# Altium schematic sheet Smartfin Main PCBA Wet Dry Sensor.SchDoc
size Letter; TOCFontName: Consolas; TOCFontSize: 24; TOCFontColor: 0; TOCFontAttributes: 0; TOCMaxLinesInTable: 25; TOCVerticalOffset: 200; TOCHorizontalOffset: 500; TOCHorizontalSeparation: 800; TOCVerticalSeparation: 30; TOCHorizTableSize: 640; PageSetup: Record=PageOptions|CenterHorizontal=True|CenterVertical=True|PrintScale=0.96|XCorrection=1.00|YCorrection=1.00|PrintKind=0|BorderSize=5000000|LeftOffset=0|BottomOffset=0|Orientation=2|PaperLength=1000|PaperWidth=1000|Scale=100|PaperSource=7|PrintQuality=-4|MediaType=1|DitherType=10|PaperKind=11" x 17"|PrintScaleMode=1; SheetNumber: 7; SheetTotal: 8
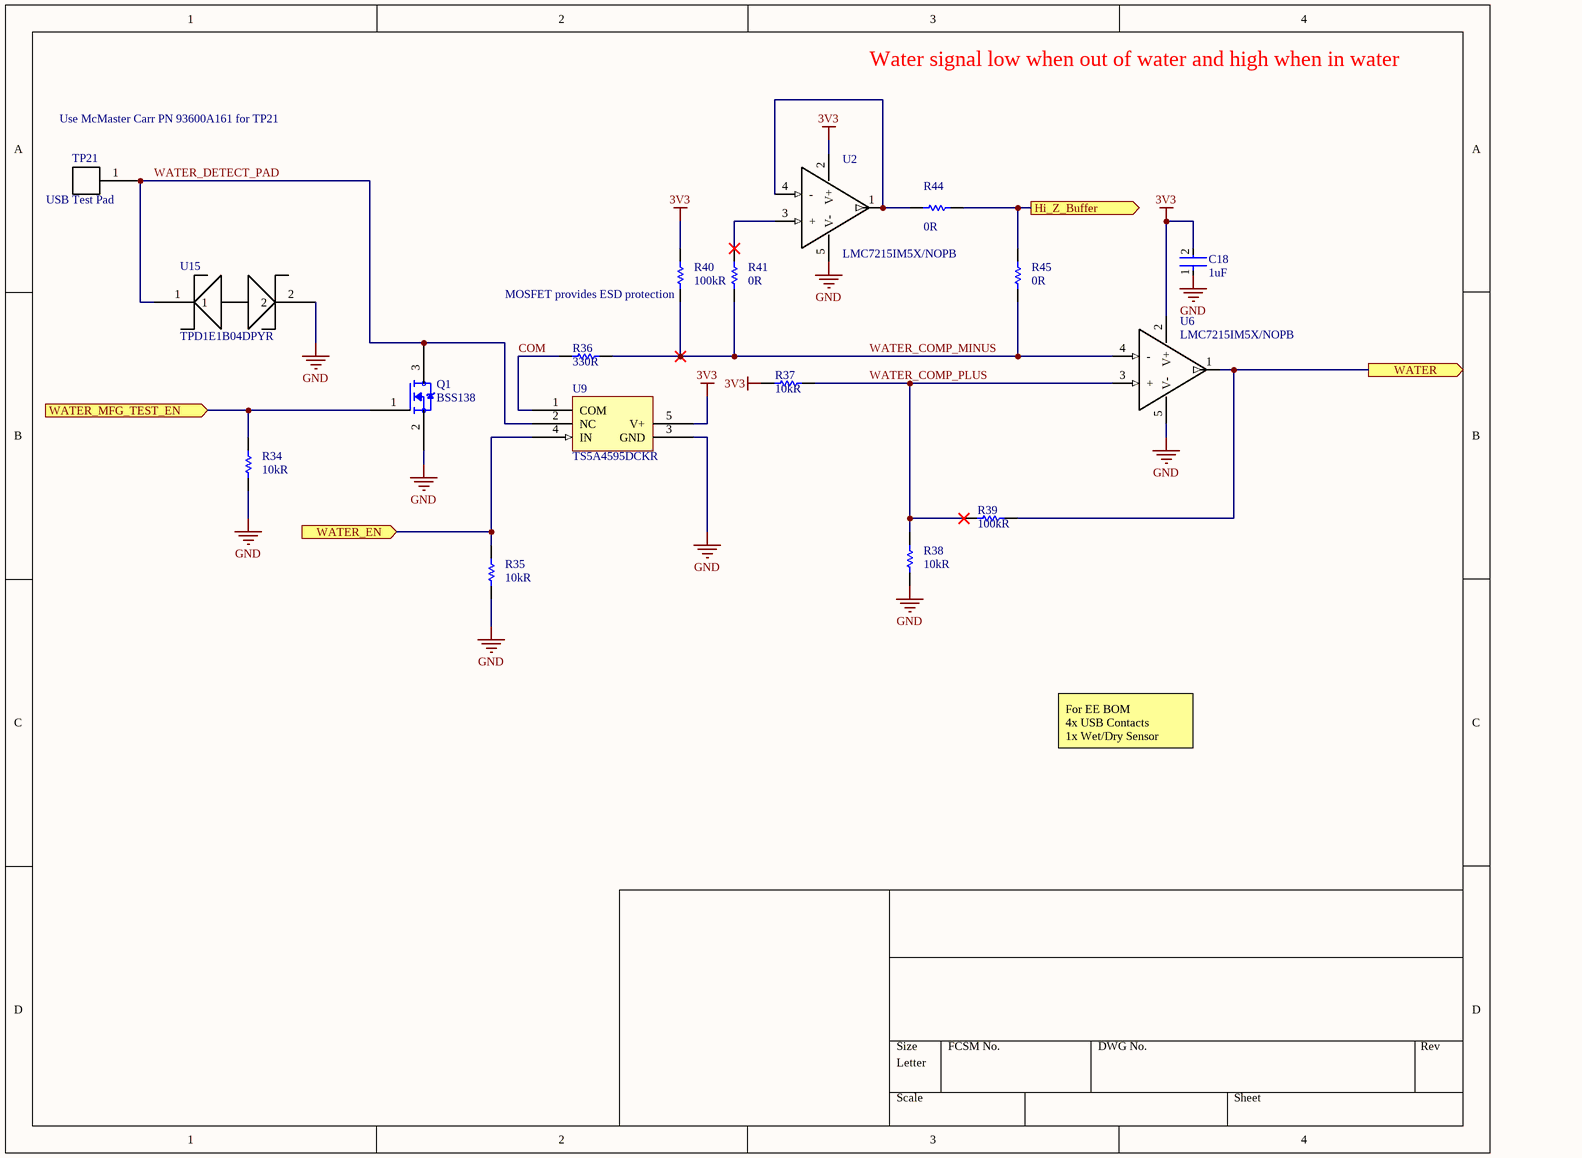
[diagram p0: Smartfin Main PCBA Wet Dry Sensor.SchDoc]

## Parts
C18  value 1uF  [FP-CC0402-IPC_C]  (hidden comment: cc0402krx5r6bb105)
Q1  BSS138  [SOT95P237X111-3N]
R34  value 10kR  [RESC1005X04N]  (hidden comment: RC0402FR-0710KL)
R35  value 10kR  [RESC1005X04N]  (hidden comment: RC0402FR-0710KL)
R36  value 330R  [RESC1005X04N]  (hidden comment: RC0402FR-07330RL)
R37  value 10kR  [RESC1005X04N]  (hidden comment: RC0402FR-0710KL)
R38  value 10kR  [RESC1005X04N]  (hidden comment: RC0402FR-0710KL)
R39  value 100kR  [RESC1005X04N]  (hidden comment: RC0402FR-07100KL)
R40  value 100kR  [RESC1005X04N]  (hidden comment: RC0402FR-07100KL)
R41  value 0R  [RESC1005X04N]  (hidden comment: RC0402JR-070RL)
R44  value 0R  [RESC1005X04N]  (hidden comment: RC0402JR-070RL)
R45  value 0R  [RESC1005X04N]  (hidden comment: RC0402JR-070RL)
TP21  USB Test Pad  [New footprint 1]
U2  LMC7215IM5X/NOPB  [SOT95P280X145-5N]
U6  LMC7215IM5X/NOPB  [SOT95P280X145-5N]
U9  TS5A4595DCKR  [SOT65P210X110-5N]
U15  TPD1E1B04DPYR  [DIO_TPD1E05U06DPYR]

## Ports
Hi_Z_Buffer (out), WATER (out), WATER_EN (in), WATER_MFG_TEST_EN (in)

## Nets
3V3: C18.2 R37.2 R40.1 U2.2(V+) U6.2(V+) U9.5(V+)
GND: C18.1 Q1.2 R34.1 R35.1 R38.2 U2.5(V-) U6.5(V-) U9.3(GND) U15.2
COM: R36.2 U9.1(COM)
Hi_Z_Buffer: R44.2 R45.2 ; port Hi_Z_Buffer
WATER: R39.1 U6.1(OUT) ; port WATER
WATER_COMP_MINUS: R36.1 R40.2 R41.1 R45.1 U6.4(-)
WATER_COMP_PLUS: R37.1 R38.1 R39.2 U6.3(+)
WATER_DETECT_PAD: Q1.3 TP21.1 U9.2(NC) U15.1
WATER_EN: R35.2 U9.4(IN) ; port WATER_EN
WATER_MFG_TEST_EN: Q1.1 R34.2 ; port WATER_MFG_TEST_EN
NetR41_2: R41.2 U2.3(+)
NetR44_1: R44.1 U2.1(OUT) U2.4(-)

## Notes on the sheet
- Water signal low when out of water and high when in water
- Use McMaster Carr PN 93600A161 for TP21
- (near R40) MOSFET provides ESD protection
- For EE BOM
  4x USB Contacts
  1x Wet/Dry Sensor Contact

## Library data of the parts
C18 = YAGEO-CC0402KRX5R6BB105-1: Ceramic Capacitor, Multilayer, Ceramic, 10V, 10% +Tol, 10% -Tol, X5R, 15% TC, 1uF, Surface Mount, 0402
Q1 = CMP-002-000027-5: N-Channel 50V 220mA (Ta) 360mW (Ta) Surface Mount SOT-23-3; MF: ON Semiconductor; Pin Count: 3; SnapEDA_Link: https://www.snapeda.com/parts/BSS138/ON%20Semiconductor/view-part/4794929/?ref=snap; Source: BSS138.SchLib; Availability: Good; Design Item ID: BSS138; Price: None; Package: SOT-23 ON Semiconductor; Component Type: Standard; MP: BSS138; Purchase-URL: https://pricing.snapeda.com/search/part/BSS138/?ref=eda; Value: *; Reach SVHC Compliant: Yes; Check_prices: https://www.snapeda.com/parts/BSS138/ON%20Semiconductor/view-part/4794929/?ref=eda; RoHS Compliant: Yes
R34 R35 R37 R38 = CMP-002-000053-2: Fixed Resistor, Metal Glaze/thick Film, 0.0625W, 10000ohm, 50V, 1% +/-Tol, 100ppm/Cel, Surface Mount, 0402
R36 = YAGEO-RC0402FR-07330RL-1: Fixed Resistor, Metal Glaze/thick Film, 0.0625W, 330ohm, 50V, 1% +/-Tol, 100ppm/Cel, Surface Mount, 0402
R39 R40 = YAGEO-RC0402FR-07100KL-1: Fixed Resistor, Metal Glaze/thick Film, 0.0625W, 100000ohm, 50V, 1% +/-Tol, 100ppm/Cel, Surface Mount, 0402
R41 R44 R45 = YAGEO-RC0402JR-070RL-1: Metal Glaze/thick Film, 0.0625W, 0ohm, Surface Mount, 0402
TP21 = CMP-002-000049-1
U2 U6 = CMP-002-000012-5: Low power, low voltage comparator with push-pull output; MF: Texas Instruments; Design Item ID: LMC7215IM5X/NOPB; MP: LMC7215IM5X/NOPB; Component Type: Standard; Availability: In Stock; Price: None; Package: SOT-23-5 Texas Instruments; Source: LMC7215IM5X_NOPB.SchLib; Check_prices: https://www.snapeda.com/parts/LMC7215IM5X/NOPB/Texas+Instruments/view-part/?ref=eda; Pin Count: 5; Purchase-URL: https://pricing.snapeda.com/search?q=LMC7215IM5X/NOPB&ref=eda; SnapEDA_Link: https://www.snapeda.com/parts/LMC7215IM5X/NOPB/Texas+Instruments/view-part/?ref=snap; Value: *
U9 = CMP-002-000032-5: Package: SOT23; Component Type: Switch; Pin Count: 5
U15 = CMP-004-000009-3: 1-channel ESD protection diode with low dynamic resistance and low clamping -Voltage 2-X1SON -40 to 125; MF: Texas Instruments; MP: TPD1E1B04DPYR; Mouser-Purchase-URL: https://snapeda.com/shop?store=Mouser&id=616615; Design Item ID: TPD1E1B04DPYR; Texas_Instruments-Purchase-URL: https://snapeda.com/shop?store=Texas+Instruments&id=616615; Availability: Warning; SnapEDA_Link: https://www.snapeda.com/parts/TPD1E1B04DPYR/Texas%20Instruments/view-part/616615/?ref=snap; Price: None; Component Type: Standard; Package: X1SON-2 Texas Instruments; Pin Count: 2; Value: *; Source: TPD1E1B04DPYR.SchLib